# EAGLE design main (EAGLE 8.7.1)
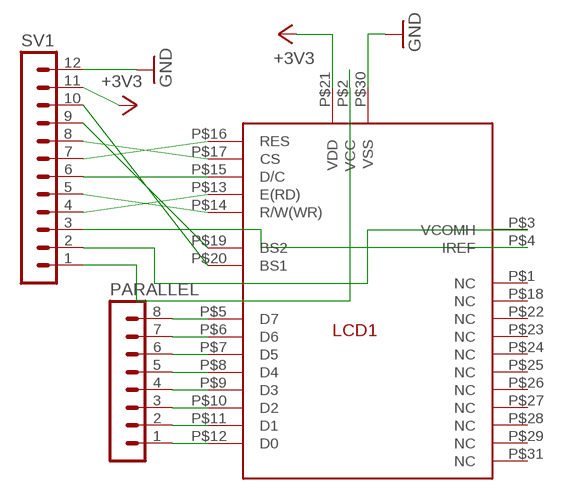
[diagram p0: schematic, sheet 1]

## Parts
LCD1  SSD1306  [SSD1306]
PARALLEL  MA08-1  [MA08-1]
SV1  MA12-1  [MA12-1]

## Nets
+3V3: LCD1.P$21(VDD) SV1.11
GND: LCD1.P$30(VSS) SV1.12
N$1: LCD1.P$12(D0) PARALLEL.1
N$2: LCD1.P$11(D1) PARALLEL.2
N$3: LCD1.P$10(D2) PARALLEL.3
N$4: LCD1.P$9(D3) PARALLEL.4
N$5: LCD1.P$8(D4) PARALLEL.5
N$6: LCD1.P$7(D5) PARALLEL.6
N$7: LCD1.P$6(D6) PARALLEL.7
N$8: LCD1.P$5(D7) PARALLEL.8
N$9: LCD1.P$20(BS1) SV1.10
N$10: LCD1.P$19(BS2) SV1.9
N$11: LCD1.P$14(R/W(WR)) SV1.5
N$12: LCD1.P$13(E(RD)) SV1.4
N$13: LCD1.P$15(D/C) SV1.6
N$14: LCD1.P$17(CS) SV1.8
N$15: LCD1.P$16(RES) SV1.7
N$16: LCD1.P$3(VCOMH) SV1.2
N$17: LCD1.P$4(IREF) SV1.3
N$18: LCD1.P$2(VCC) SV1.1
Unconnected: LCD1.P$1(NC) LCD1.P$18(NC) LCD1.P$22(NC) LCD1.P$23(NC) LCD1.P$24(NC) LCD1.P$25(NC) LCD1.P$26(NC) LCD1.P$27(NC) LCD1.P$28(NC) LCD1.P$29(NC) LCD1.P$31(NC)

## Library data of the parts
LCD1 = 7_segment_lib:SSD1306
PARALLEL = con-lstb:MA08-1: PIN HEADER; OC_FARNELL: unknown; OC_NEWARK: unknown
SV1 = con-lstb:MA12-1: PIN HEADER; OC_FARNELL: unknown; OC_NEWARK: unknown

## Board
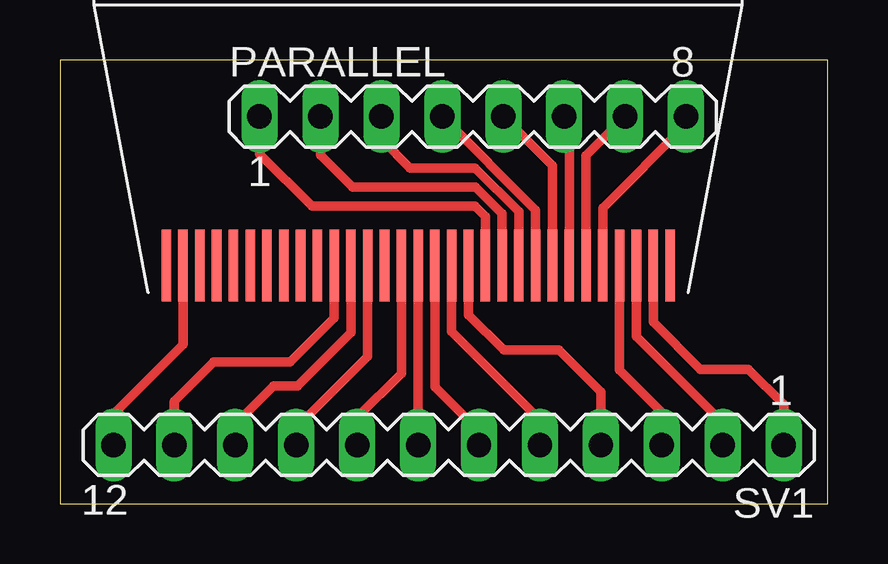
[diagram p1: board, top side]

Size 32 x 18.5 mm. Coordinates in mm from the lower left corner, seen from the top.
Outline: 0,0 32,0 32,18.5 0,18.5 0,0
Copper layers (1*16): Top 0.035mm / dielectric 1.5mm / Bottom 0.035mm
Design rules "default": minimum track width 6mil, minimum drill 0.35mm, track to track 6mil, track to pad 6mil, pad to pad 6mil, via to via 6mil, smd to smd 6mil, copper to edge 40mil, drill to drill 6mil, minimum pad ring 10mil, minimum via ring 8mil, stop-mask expansion 4mil, vias tented up to drill 0mil, thermal gap 10mil

### Footprints (pad centres in the part's own frame; a part is rotated, then mirrored left to right if it is on the bottom)
SSD1306 = smd 0.4 x 3: P$1 10.5,1.14; P$2 9.8,1.14; P$3 9.1,1.14; P$4 8.4,1.14; P$5 7.7,1.14; P$6 7,1.14; P$7 6.3,1.14; P$8 5.6,1.14; P$9 4.9,1.14; P$10 4.2,1.14; P$11 3.5,1.14; P$12 2.8,1.14; P$13 2.1,1.14; P$14 1.4,1.14; P$15 0.7,1.14; P$16 0,1.14; P$17 -0.7,1.14; P$18 -1.4,1.14; P$19 -2.1,1.14; P$20 -2.8,1.14; P$21 -3.5,1.14; P$22 -4.2,1.14; P$23 -4.9,1.14; P$24 -5.6,1.14; P$25 -6.3,1.14; P$26 -7,1.14; P$27 -7.7,1.14; P$28 -8.4,1.14; P$29 -9.1,1.14; P$30 -9.8,1.14; P$31 -10.5,1.14
MA08-1 = drill 1.016 long: 1 -8.89,0; 2 -6.35,0; 3 -3.81,0; 4 -1.27,0; 5 1.27,0; 6 3.81,0; 7 6.35,0; 8 8.89,0
MA12-1 = drill 1.016 long: 1 -13.97,0; 2 -11.43,0; 3 -8.89,0; 4 -6.35,0; 5 -3.81,0; 6 -1.27,0; 7 1.27,0; 8 3.81,0; 9 6.35,0; 10 8.89,0; 11 11.43,0; 12 13.97,0

### Placement (x,y rotation side)
LCD1  14.93,8.79 0 top
PARALLEL  17.21,16.14 0 top
SV1  16.2,2.44 180 top

### Tracks (layer width: path | path; a pad name or v marks a point on that pad's centre or on a via)
+3V3
  Top 0.4: LCD1.P$21 11.43,7.73 9.6,5.9 6.4,5.9 4.77,4.27 SV1.11
GND
  Top 0.4: LCD1.P$30 5.13,6.63 2.23,3.73 SV1.12
N$1
  Top 0.4: LCD1.P$12 17.73,11.97 17.3,12.4 10.5,12.4 8.32,14.58 PARALLEL.1
N$2
  Top 0.4: PARALLEL.2 10.86,14.54 12.2,13.2 17.32,13.2 18.43,12.09 LCD1.P$11
N$3
  Top 0.4: PARALLEL.3 13.4,15.2 14.6,14 17.3,14 19.13,12.17 LCD1.P$10
N$4
  Top 0.4: LCD1.P$9 19.83,12.25 PARALLEL.4
N$5
  Top 0.4: LCD1.P$8 20.53,14.09 PARALLEL.5
N$6
  Top 0.4: LCD1.P$7 21.23,15.93 PARALLEL.6
N$7
  Top 0.4: LCD1.P$6 21.93,14.51 PARALLEL.7
N$8
  Top 0.4: LCD1.P$5 22.63,12.33 26.1,15.8 PARALLEL.8
N$9
  Top 0.4: LCD1.P$20 12.13,7.13 9.9,4.9 8.9,4.9 7.3,3.3 7.31,3.29 SV1.10
N$10
  Top 0.4: LCD1.P$19 12.83,6.13 9.85,3.15 SV1.9
N$11
  Top 0.4: LCD1.P$14 16.33,7.17 20.01,3.49 SV1.5
N$12
  Top 0.4: LCD1.P$13 17.03,7.87 18.5,6.4 20.8,6.4 22.55,4.65 SV1.4
N$13
  Top 0.4: LCD1.P$15 15.63,4.87 17.47,3.03 SV1.6
N$14
  Top 0.4: LCD1.P$17 14.23,5.43 12.39,3.59 SV1.8
N$15
  Top 0.4: LCD1.P$16 SV1.7
N$16
  Top 0.4: LCD1.P$3 24.03,6.97 27.63,3.37 SV1.2
N$17
  Top 0.4: LCD1.P$4 23.33,5.57 25.1,3.8 SV1.3
N$18
  Top 0.4: LCD1.P$2 24.73,7.57 26.7,5.6 28.7,5.6 30.17,4.13 SV1.1